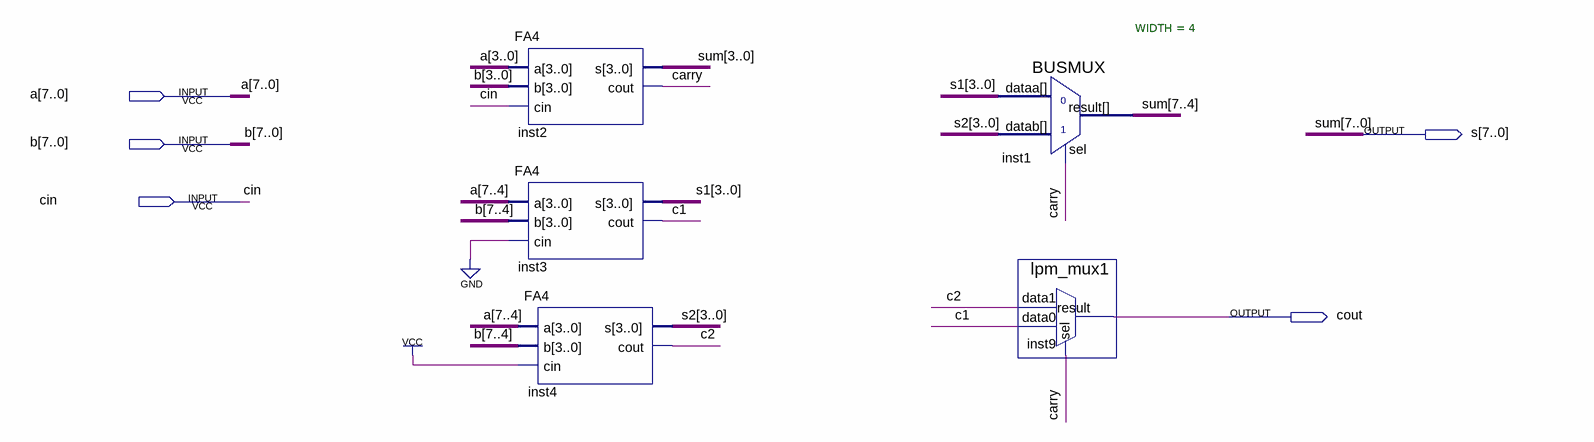
[diagram p0: schematic sheet]
// Quartus schematic adder.bdf as structural Verilog: 5 symbols, 5 pins
module adder (
  input  [7:0] a,
  input  [7:0] b,
  input  cin,
  output [7:0] s,
  output cout
);

  wire c1, c2, carry;
  wire [3:0] s1, s2;

  FA4 inst2 (.a(a[3:0]), .b(b[3:0]), .cin(cin), .s(s[3:0]), .cout(carry));
  FA4 inst3 (.a(a[7:4]), .b(b[7:4]), .cin(1'b0), .s(s1), .cout(c1));
  FA4 inst4 (.a(a[7:4]), .b(b[7:4]), .cin(1'b1), .s(s2), .cout(c2));
  BUSMUX #(.WIDTH(4)) inst1 (.datab(s2), .sel(carry), .dataa(s1), .result(s[7:4]));
  lpm_mux1 inst9 (.data1(c2), .data0(c1), .sel(carry), .result(cout));

  // Other names for the same wires on the sheet: sum[7:0] = s
endmodule
